# EAGLE schematic sub_sys_pdu (EAGLE 9.6.0)
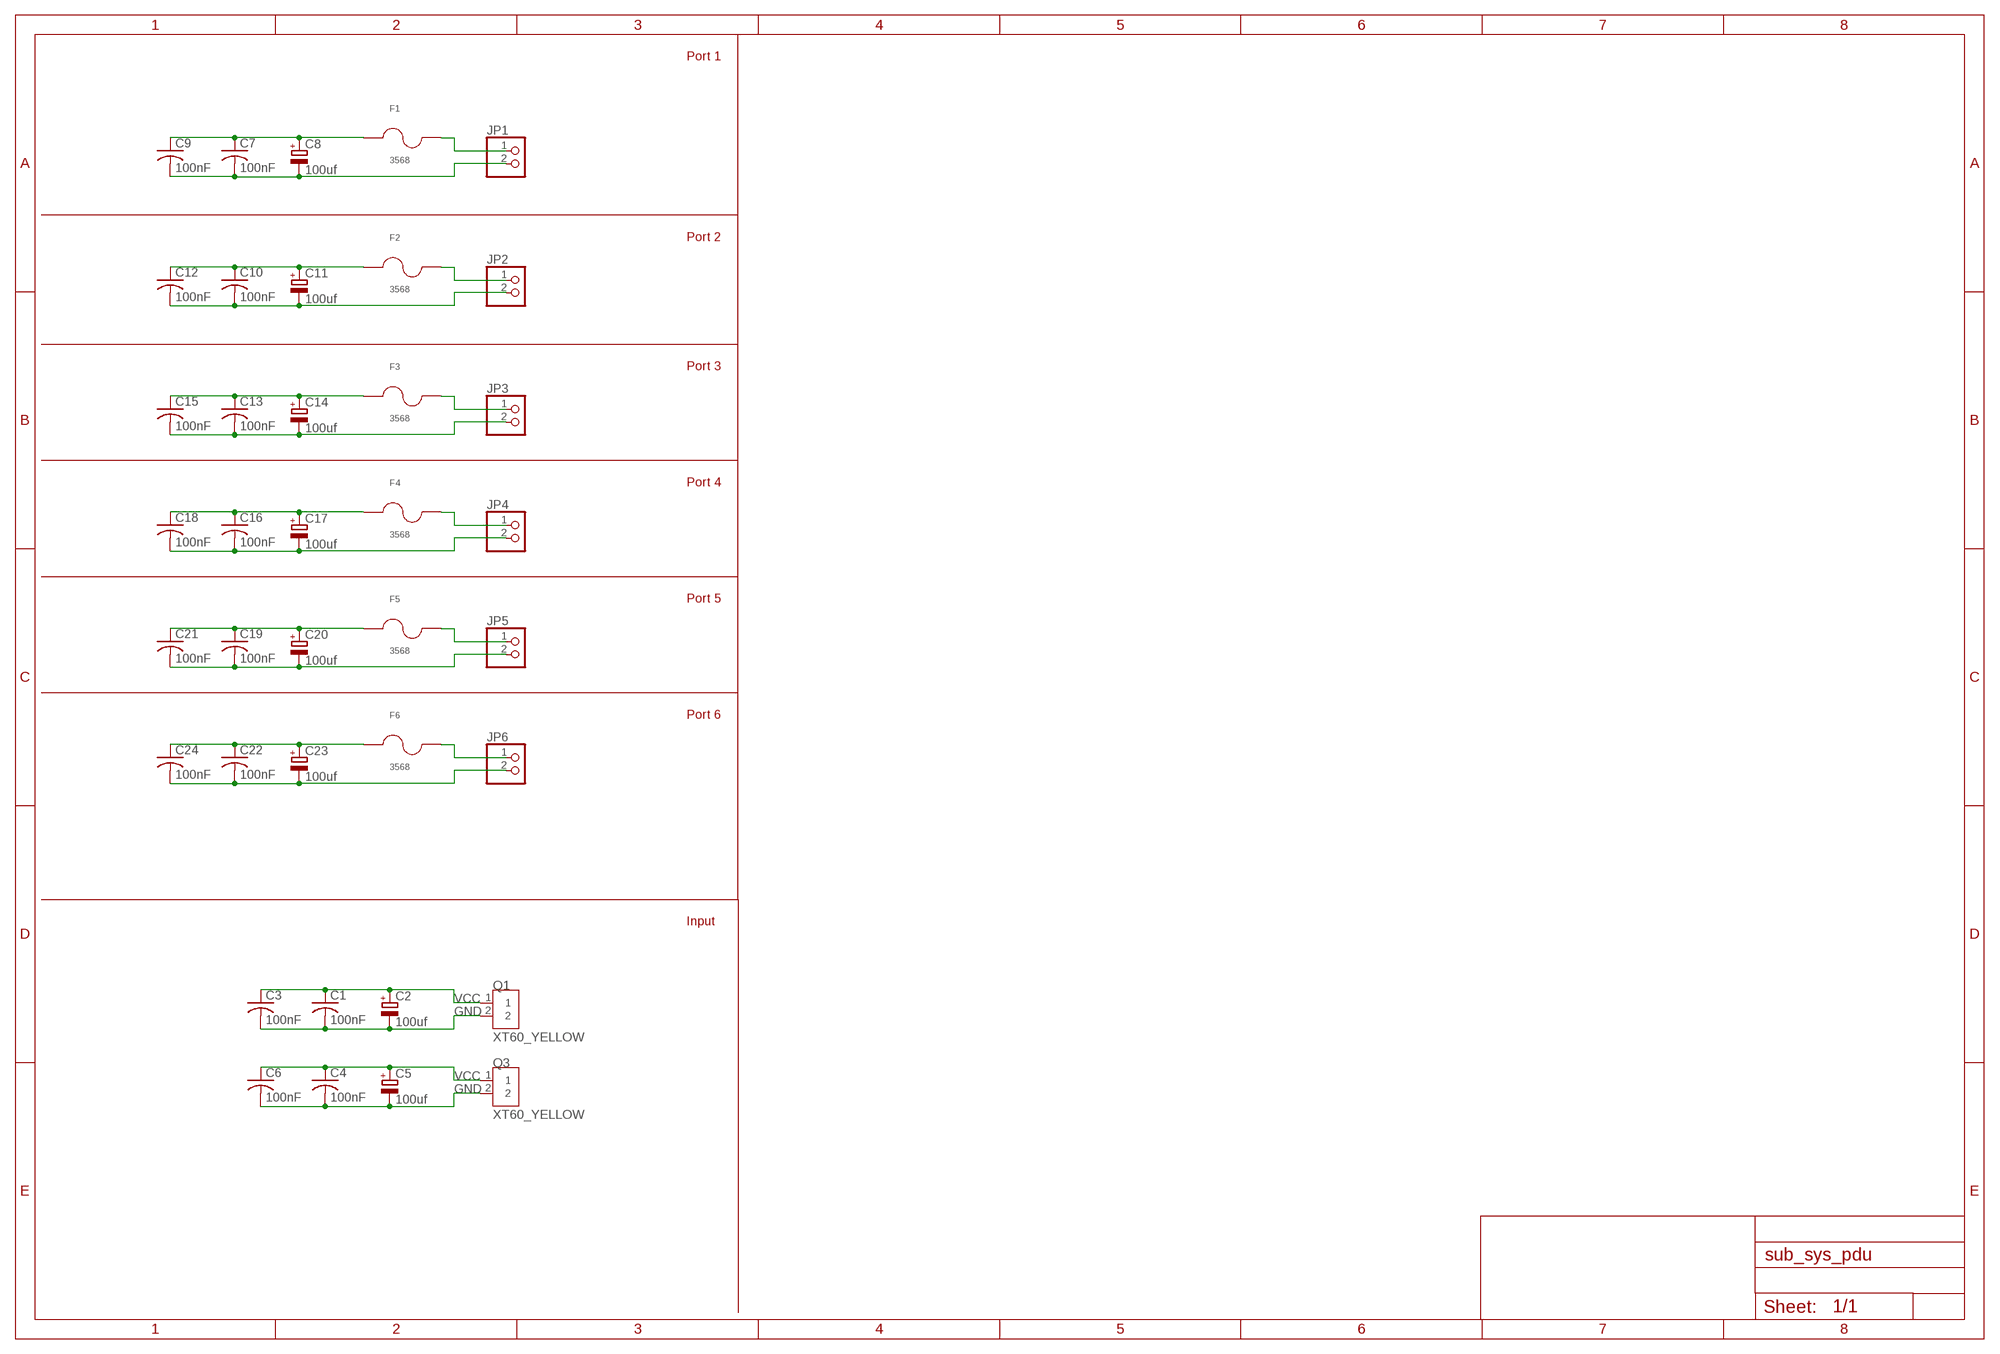
[diagram p0: schematic, sheet 1]

## Parts
C1  100nF  C-USC0805  [C0805]
C2  100uf  CPOL-EUE5-10.5  [E5-10,5]
C3  100nF  C-USC0805  [C0805]
C4  100nF  C-USC0805  [C0805]
C5  100uf  CPOL-EUE5-10.5  [E5-10,5]
C6  100nF  C-USC0805  [C0805]
C7  100nF  C-USC0805  [C0805]
C8  100uf  CPOL-EUE5-10.5  [E5-10,5]
C9  100nF  C-USC0805  [C0805]
C10  100nF  C-USC0805  [C0805]
C11  100uf  CPOL-EUE5-10.5  [E5-10,5]
C12  100nF  C-USC0805  [C0805]
C13  100nF  C-USC0805  [C0805]
C14  100uf  CPOL-EUE5-10.5  [E5-10,5]
C15  100nF  C-USC0805  [C0805]
C16  100nF  C-USC0805  [C0805]
C17  100uf  CPOL-EUE5-10.5  [E5-10,5]
C18  100nF  C-USC0805  [C0805]
C19  100nF  C-USC0805  [C0805]
C20  100uf  CPOL-EUE5-10.5  [E5-10,5]
C21  100nF  C-USC0805  [C0805]
C22  100nF  C-USC0805  [C0805]
C23  100uf  CPOL-EUE5-10.5  [E5-10,5]
C24  100nF  C-USC0805  [C0805]
F1  3568  [FUSE_3568]
F2  3568  [FUSE_3568]
F3  3568  [FUSE_3568]
F4  3568  [FUSE_3568]
F5  3568  [FUSE_3568]
F6  3568  [FUSE_3568]
JP1  PINHD-1X2  [1X02]
JP2  PINHD-1X2  [1X02]
JP3  PINHD-1X2  [1X02]
JP4  PINHD-1X2  [1X02]
JP5  PINHD-1X2  [1X02]
JP6  PINHD-1X2  [1X02]
Q1  XT60_YELLOW  [AMASS_XT60PB-M]
Q3  XT60_YELLOW  [AMASS_XT60PB-M]

## Nets
GND: C1.2 C2.- C3.2 C4.2 C5.- C6.2 Q1.2 Q3.2
GND1: C7.2 C8.- C9.2 JP1.2
GND2: C10.2 C11.- C12.2 JP2.2
GND3: C13.2 C14.- C15.2 JP3.2
GND4: C16.2 C17.- C18.2 JP4.2
GND5: C19.2 C20.- C21.2 JP5.2
GND6: C22.2 C23.- C24.2 JP6.2
N$1: F1.2 F1.4 JP1.1
N$3: F2.2 F2.4 JP2.1
N$4: F3.2 F3.4 JP3.1
N$5: F4.2 F4.4 JP4.1
N$6: F5.2 F5.4 JP5.1
N$7: F6.2 F6.4 JP6.1
VCC: C1.1 C2.+ C3.1 C4.1 C5.+ C6.1 Q1.1 Q3.1
VCC1: C7.1 C8.+ C9.1 F1.1 F1.3
VCC2: C10.1 C11.+ C12.1 F2.1 F2.3
VCC3: C13.1 C14.+ C15.1 F3.1 F3.3
VCC4: C16.1 C17.+ C18.1 F4.1 F4.3
VCC5: C19.1 C20.+ C21.1 F5.1 F5.3
VCC6: C22.1 C23.+ C24.1 F6.1 F6.3

## Notes on the sheet
- Port 1
- Port 2
- Port 3
- Port 4
- Port 5
- Port 6
- Input

## Library data of the parts
C1 C3 C4 C6 C7 C9 C10 C12 C13 C15 C16 C18 C19 C21 C22 C24 = rcl:C-US: CAPACITOR, American symbol; SPICEPREFIX: C
C2 C5 C8 C11 C14 C17 C20 C23 = rcl:CPOL-EU: POLARIZED CAPACITOR, European symbol; SPICEPREFIX: C
F1-F6 = 3568:3568: Auto Fuse Holder; Mini; THM; 1 Fuse; 30Amp; Hi-Temp Nylon; UL94V-0; Brass/Tin; AVAILABILITY: Unavailable; DESCRIPTION: STEMMA CABLE - 150MM/6 LONG 4 PI; MF: Adafruit Industries; MP: 3568; PACKAGE: None; PRICE: None
JP1-JP6 = pinhead:PINHD-1X2: PIN HEADER
Q1 Q3 = XT60_YELLOW:XT60_YELLOW: Connector 2 pins; AVAILABILITY: Unavailable; DESCRIPTION: Power connector; 65A; PIN: 2; Colour: yellow; MF: Pololu; MP: XT60 YELLOW; PACKAGE: None; PRICE: None